# Altium schematic sheet STM32_FFT.SchDoc
size A3
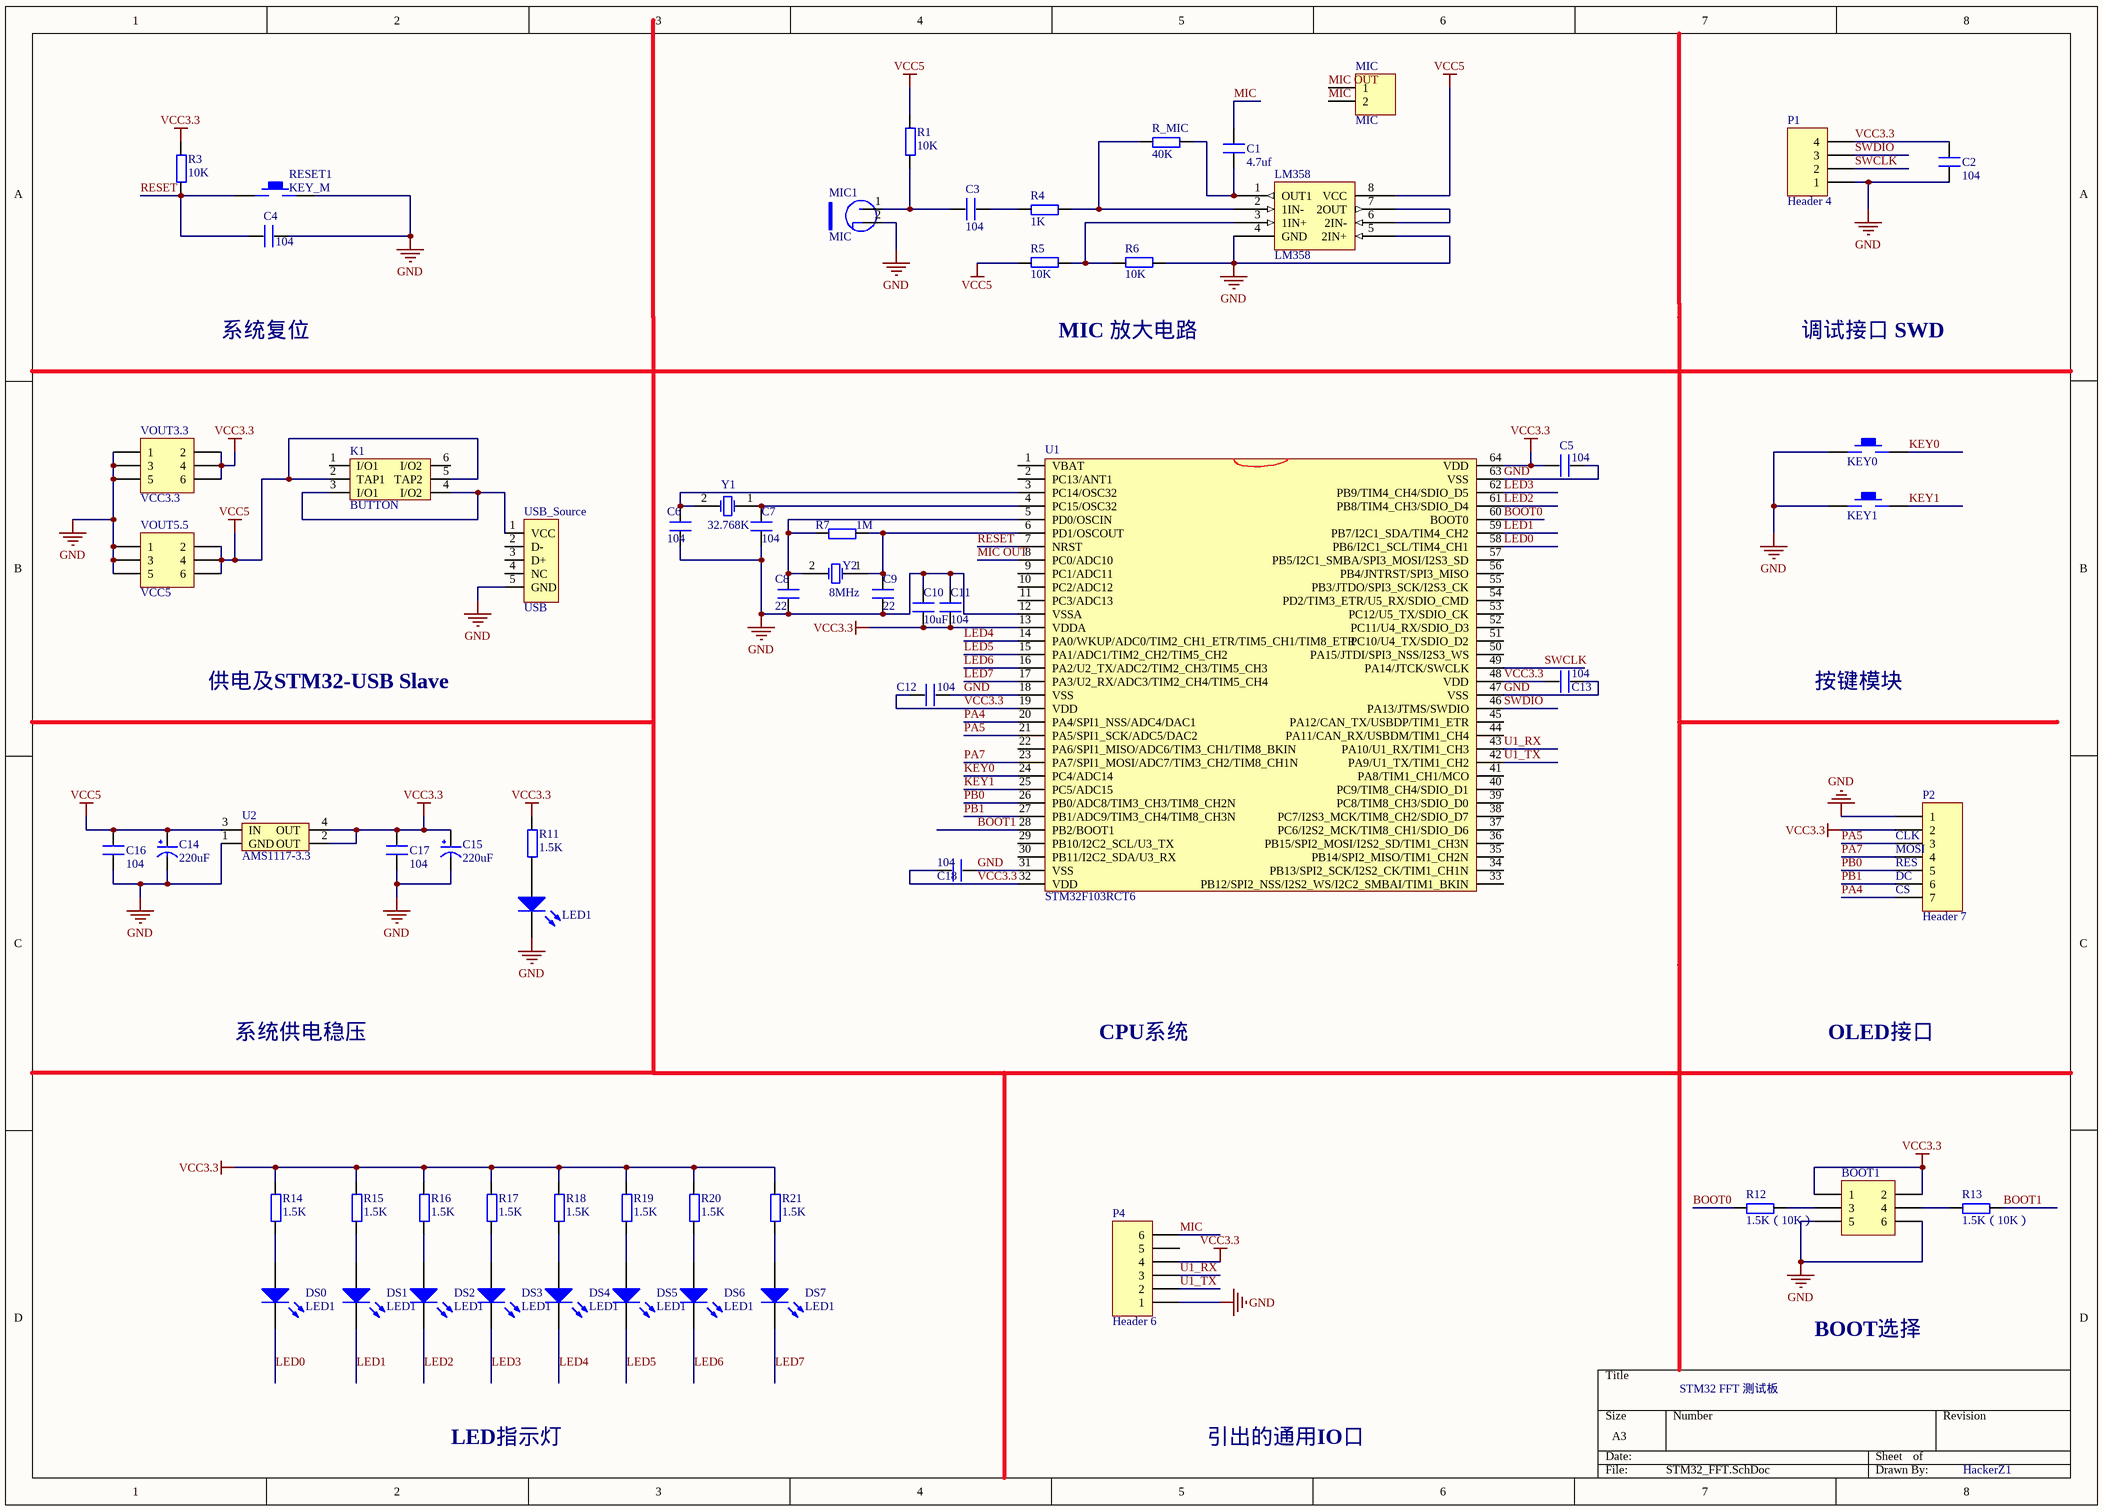
[diagram p0: STM32_FFT.SchDoc]

## Parts
BOOT1  VCC5  [HDR2X3]  (value not drawn)
C1  4.7uf  [0603P]
C2  104  [0603P]
C3  104  [0603P]
C4  104  [0603P]
C5  104  [0603P]
C6  104  [0603P]
C7  104  [0603P]
C8  22  [0603P]
C9  22  [0603P]
C10  10uF  [0603P]
C11  104  [0603P]
C12  104  [0603P]
C13  104  [0603P]
C14  220uF  [CC6.56.5]
C15  220uF  [CC6.56.5]
C16  104  [0603P]
C17  104  [0603P]
C18  104  [0603P]
DS0  LED1  [SMDLED]
DS1  LED1  [SMDLED]
DS2  LED1  [SMDLED]
DS3  LED1  [SMDLED]
DS4  LED1  [SMDLED]
DS5  LED1  [SMDLED]
DS6  LED1  [SMDLED]
DS7  LED1  [SMDLED]
DS_source  LED1  [SMDLED]
K1  BUTTON  [BTN8.5*8.5]
KEY0  KEY_M  [KEY_M]  (value not drawn)
KEY1  KEY_M  [KEY_M]  (value not drawn)
LM358  LM358  [LC-DIP-8]
MIC  MIC  [HDR1X2]
MIC1  MIC  [MIC]
P1  Header 4  [HDR1X4]
P2  Header 7  [HDR1X7]
P4  Header 6  [HDR1X6]
R1  10K  [0603P]
R3  10K  [0603P]
R4  1K  [0603P]
R5  10K  [0603P]
R6  10K  [0603P]
R7  1M  [0603P]
R11  1.5K  [0603P]
R12  1.5K（10K）  [0603P]
R13  1.5K（10K）  [0603P]
R14  1.5K  [0603P]
R15  1.5K  [0603P]
R16  1.5K  [0603P]
R17  1.5K  [0603P]
R18  1.5K  [0603P]
R19  1.5K  [0603P]
R20  1.5K  [0603P]
R21  1.5K  [0603P]
R_MIC  40K  [0603P]
RESET1  KEY_M  [KEY_M]
U1  STM32F103RCT6  [STM-LQFP64_M]
U2  AMS1117-3.3  [AMS1117]
USB_Source  USB  [USB/SM0.8-6H5]
VOUT3.3  VCC3.3  [HDR2X3]
VOUT5.5  VCC5  [HDR2X3]
Y1  32.768K  [XTAL_US]
Y2  8MHz  [XTAL_US]

## Nets
GND: BOOT1.5 BOOT1.6 C2.1 C4.2 C5.2 C6.1 C7.1 C8.1 C9.1 C10.2 C11.2 C12.2 C13.2 C14.2(GND) C15.2(GND) C16.1 C17.1 C18.2 DS_source.2(K) KEY0.1 KEY1.1 LM358.4(GND) LM358.5(2IN+) MIC1.2(GND) P1.1 P2.1 P4.1 R6.1 RESET1.2 U1.12(VSSA) U1.18(VSS) U1.31(VSS) U1.47(VSS) U1.63(VSS) U2.1(GND) USB_Source.5(GND) VOUT3.3.1 VOUT3.3.3 VOUT3.3.5 VOUT5.5.1 VOUT5.5.3 VOUT5.5.5
VCC3.3: BOOT1.1 BOOT1.2 C2.2 C5.1 C10.1 C11.1 C12.1 C13.1 C15.1(VCC) C17.2 C18.1 P1.4 P2.2 P4.4 R3.2 R11.2 R14.2 R15.2 R16.2 R17.2 R18.2 R19.2 R20.2 R21.2 U1.13(VDDA) U1.19(VDD) U1.32(VDD) U1.48(VDD) U1.64(VDD) U2.2(OUT) U2.4(OUT) VOUT3.3.2 VOUT3.3.4 VOUT3.3.6
VCC5: C14.1(VCC) C16.2 K1.2(TAP1) K1.5(TAP2) LM358.8(VCC) R1.2 R5.2 U2.3(IN) VOUT5.5.2 VOUT5.5.4 VOUT5.5.6
BOOT0: R12.1 U1.60(BOOT0)
BOOT1: R13.2 U1.28(PB2/BOOT1)
KEY0: KEY0.2 U1.24(PC4/ADC14)
KEY1: KEY1.2 U1.25(PC5/ADC15)
LED0: DS0.2(K) U1.58(PB6/I2C1_SCL/TIM4_CH1)
LED1: DS1.2(K) U1.59(PB7/I2C1_SDA/TIM4_CH2)
LED2: DS2.2(K) U1.61(PB8/TIM4_CH3/SDIO_D4)
LED3: DS3.2(K) U1.62(PB9/TIM4_CH4/SDIO_D5)
LED4: DS4.2(K) U1.14(PA0/WKUP/ADC0/TIM2_CH1_ETR/TIM5_CH1/TIM8_ETR)
LED5: DS5.2(K) U1.15(PA1/ADC1/TIM2_CH2/TIM5_CH2)
LED6: DS6.2(K) U1.16(PA2/U2_TX/ADC2/TIM2_CH3/TIM5_CH3)
LED7: DS7.2(K) U1.17(PA3/U2_RX/ADC3/TIM2_CH4/TIM5_CH4)
MIC: C1.2 MIC.2 P4.6
MIC OUT: MIC.1 U1.8(PC0/ADC10)
PA4: P2.7 U1.20(PA4/SPI1_NSS/ADC4/DAC1)
PA5: P2.3 U1.21(PA5/SPI1_SCK/ADC5/DAC2)
PA7: P2.4 U1.23(PA7/SPI1_MOSI/ADC7/TIM3_CH2/TIM8_CH1N)
PB0: P2.5 U1.26(PB0/ADC8/TIM3_CH3/TIM8_CH2N)
PB1: P2.6 U1.27(PB1/ADC9/TIM3_CH4/TIM8_CH3N)
RESET: C4.1 R3.1 RESET1.1 U1.7(NRST)
SWCLK: P1.2 U1.49(PA14/JTCK/SWCLK)
SWDIO: P1.3 U1.46(PA13/JTMS/SWDIO)
U1_RX: P4.3 U1.43(PA10/U1_RX/TIM1_CH3)
U1_TX: P4.2 U1.42(PA9/U1_TX/TIM1_CH2)
NetBOOT1_3: BOOT1.3 R12.2
NetBOOT1_4: BOOT1.4 R13.1
NetC1_1: C1.1 LM358.1(OUT1) R_MIC.2
NetC3_1: C3.1 MIC1.1(VCC) R1.1
NetC3_2: C3.2 R4.1
NetC6_2: C6.2 U1.3(PC14/OSC32) Y1.2(OSC2)
NetC7_2: C7.2 U1.4(PC15/OSC32) Y1.1(OSC1)
NetC8_2: C8.2 R7.1 U1.5(PD0/OSCIN) Y2.2(OSC2)
NetC9_2: C9.2 R7.2 U1.6(PD1/OSCOUT) Y2.1(OSC1)
NetDS0_1: DS0.1(A) R14.1
NetDS1_1: DS1.1(A) R15.1
NetDS2_1: DS2.1(A) R16.1
NetDS3_1: DS3.1(A) R17.1
NetDS4_1: DS4.1(A) R18.1
NetDS5_1: DS5.1(A) R19.1
NetDS6_1: DS6.1(A) R20.1
NetDS7_1: DS7.1(A) R21.1
NetDS_source_1: DS_source.1(A) R11.1
NetK1_3: K1.3(I/O1) K1.4(I/O2) USB_Source.1(VCC)
NetLM358_2: LM358.2(1IN-) R4.2 R_MIC.1
NetLM358_3: LM358.3(1IN+) R5.1 R6.2
NetLM358_6: LM358.6(2IN-) LM358.7(2OUT)

Not connected (* = marked no-connect by the designer): K1 1(I/O1) 6(I/O2); P4 5; U1 1(VBAT) 2(PC13/ANT1) 9(PC1/ADC11) 10(PC2/ADC12) 11(PC3/ADC13) 22(PA6/SPI1_MISO/ADC6/TIM3_CH1/TIM8_BKIN) 29(PB10/I2C2_SCL/U3_TX) 30(PB11/I2C2_SDA/U3_RX) 33(PB12/SPI2_NSS/I2S2_WS/I2C2_SMBAI/TIM1_BKIN) 34(PB13/SPI2_SCK/I2S2_CK/TIM1_CH1N) 35(PB14/SPI2_MISO/TIM1_CH2N) 36(PB15/SPI2_MOSI/I2S2_SD/TIM1_CH3N) 37(PC6/I2S2_MCK/TIM8_CH1/SDIO_D6) 38(PC7/I2S3_MCK/TIM8_CH2/SDIO_D7) 39(PC8/TIM8_CH3/SDIO_D0) 40(PC9/TIM8_CH4/SDIO_D1) 41(PA8/TIM1_CH1/MCO) 44(PA11/CAN_RX/USBDM/TIM1_CH4) 45(PA12/CAN_TX/USBDP/TIM1_ETR) 50(PA15/JTDI/SPI3_NSS/I2S3_WS) 51(PC10/U4_TX/SDIO_D2) 52(PC11/U4_RX/SDIO_D3) 53(PC12/U5_TX/SDIO_CK) 54(PD2/TIM3_ETR/U5_RX/SDIO_CMD) 55(PB3/JTDO/SPI3_SCK/I2S3_CK) 56(PB4/JNTRST/SPI3_MISO) 57(PB5/I2C1_SMBA/SPI3_MOSI/I2S3_SD); USB_Source 2(D-) 3(D+) 4(NC)

## Notes on the sheet
- 系统复位
- MIC 放大电路
- 调试接口 SWD
- 供电及STM32-USB Slave
- 按键模块
- (near P2) CLK
- (near P2) MOSI
- (near P2) RES
- (near P2) DC
- (near P2) CS
- 系统供电稳压
- CPU系统
- OLED接口
- STM32 FFT 测试板
- BOOT选择
- LED指示灯
- 引出的通用IO口
- HackerZ1

## Library data of the parts
BOOT1 VOUT3.3 VOUT5.5 = Header 3X2: Header, 3-Pin, Dual row; LatestRevisionDate: 17-Jul-2002; LatestRevisionNote: Re-released for DXP Platform.; Publisher: Altium Limited
C1-C13 C16-C18 = C
C14 C15 = CAP
DS0-DS7 DS_source = LED2: Typical RED, GREEN, YELLOW, AMBER GaAs LED; Published: 8-Jun-2000; LatestRevisionDate: 17-Jul-2002; LatestRevisionNote: Re-released for DXP Platform.; PackageDocument: Feb-2002; PackageReference: 3.2X1.6X1.1; Publisher: Altium Limited
MIC = Header 2: Header, 2-Pin; LatestRevisionDate: 17-Jul-2002; LatestRevisionNote: Re-released for DXP Platform.; Publisher: Altium Limited
P1 = Header 4: Header, 4-Pin; LatestRevisionDate: 17-Jul-2002; LatestRevisionNote: Re-released for DXP Platform.; Publisher: Altium Limited
P2 = Header 7: Header, 7-Pin; LatestRevisionDate: 17-Jul-2002; LatestRevisionNote: Re-released for DXP Platform.; Publisher: Altium Limited
P4 = Header 6: Header, 6-Pin; LatestRevisionDate: 17-Jul-2002; LatestRevisionNote: Re-released for DXP Platform.; Publisher: Altium Limited
R1 R3-R7 R11-R21 R_MIC = R
U1 = STM32F103RDT6
U2 = AMS1117
USB_Source = USB5
Y1 Y2 = XTAL: Crystal Oscillator; Published: 8-Jun-2000; LatestRevisionDate: 17-Jul-2002; LatestRevisionNote: Re-released for DXP Platform.; Publisher: Altium Limited